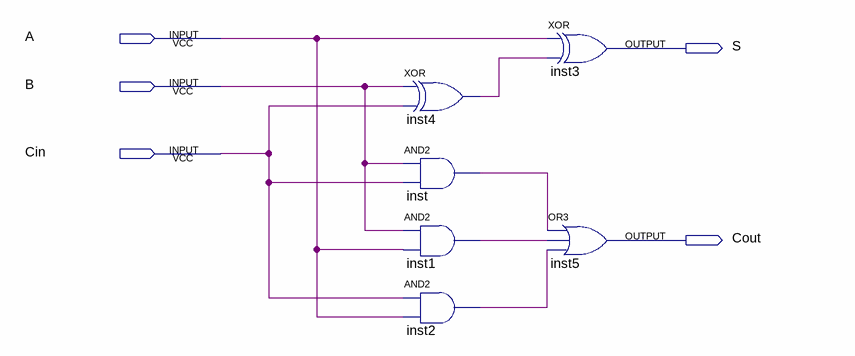
[diagram p0: schematic sheet]
// Quartus schematic Block1.bdf as structural Verilog: 6 symbols, 5 pins
module Block1 (
  input  A,
  input  B,
  input  Cin,
  output S,
  output Cout
);

  wire inst1_out, inst2_out, inst4_out, inst_out;

  xor inst4 (inst4_out, B, Cin);
  and inst (inst_out, B, Cin);
  and inst1 (inst1_out, B, A);
  and inst2 (inst2_out, Cin, A);
  xor inst3 (S, A, inst4_out);
  or inst5 (Cout, inst_out, inst1_out, inst2_out);
endmodule
